# Altium schematic sheet Buttons.SchDoc
size Letter
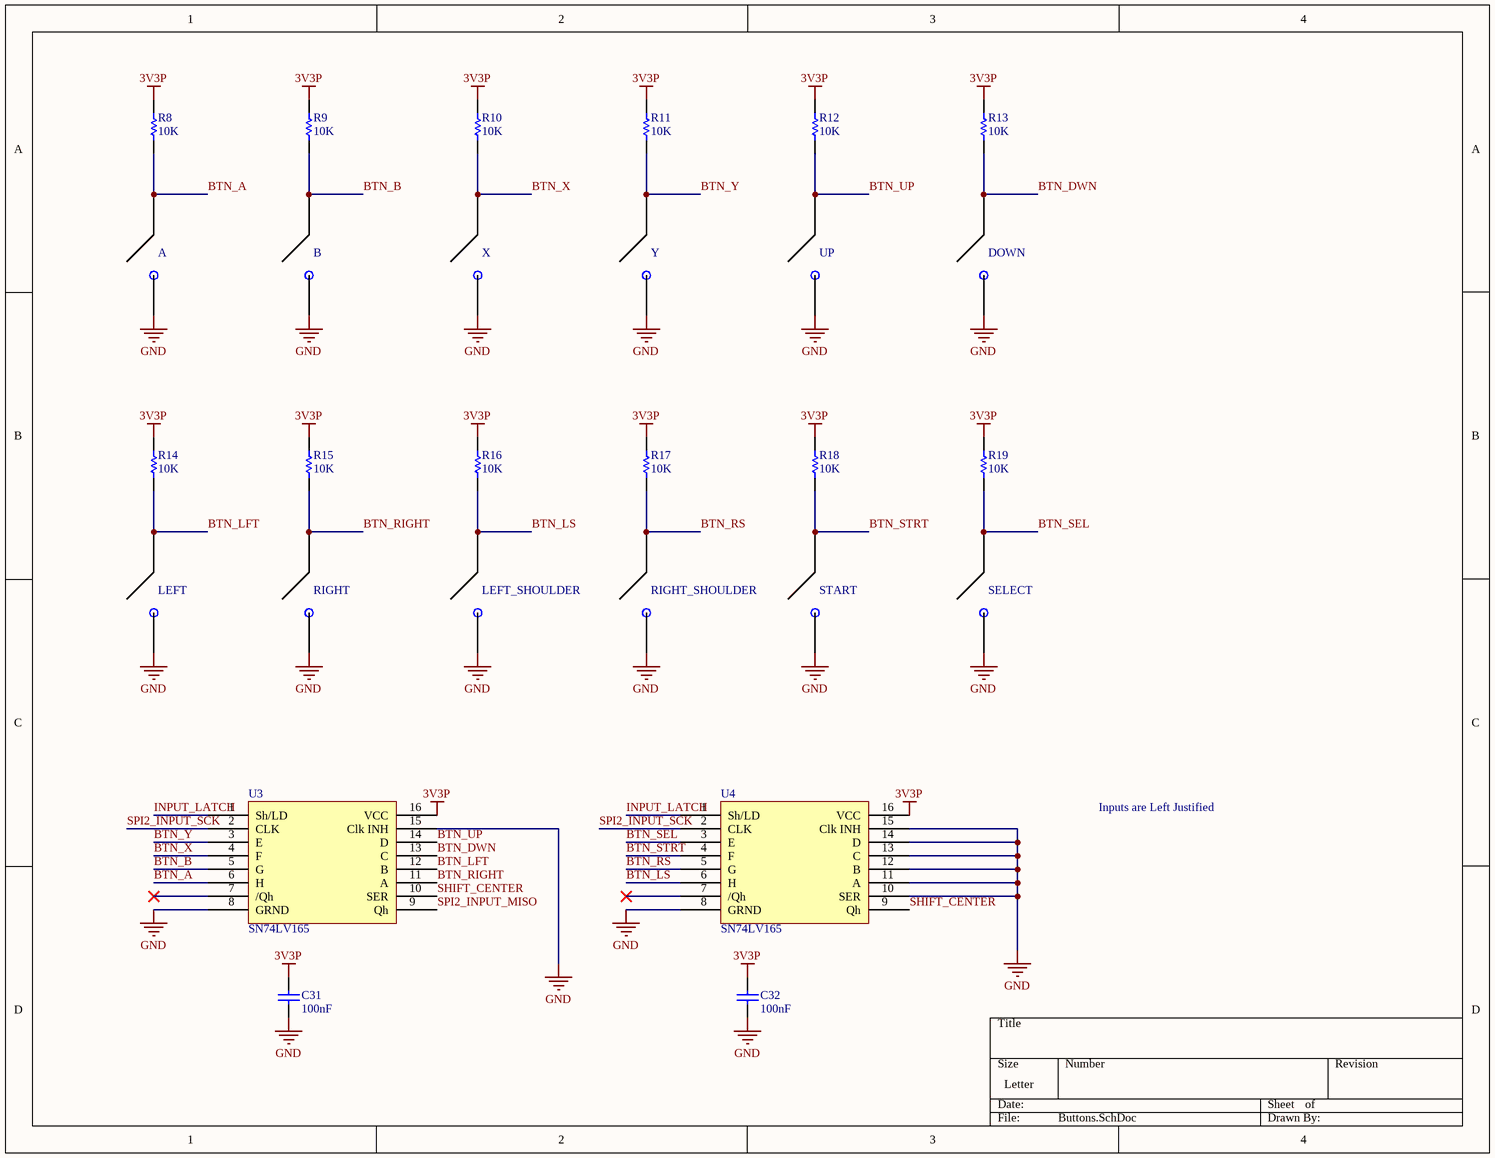
[diagram p0: Buttons.SchDoc]

## Parts
A  12mmBTN  [SMT12mmbutton]  (value not drawn)
B  12mmBTN  [SMT12mmbutton]  (value not drawn)
C31  100nF  [C0805]
C32  100nF  [C0805]
DOWN  12mmBTN  [SMT12mmbutton]  (value not drawn)
LEFT  12mmBTN  [SMT12mmbutton]  (value not drawn)
LEFT_SHOULDER  12mmBTN  [HDR1X2]  (value not drawn)
R8  10K  [6-0805_M]
R9  10K  [6-0805_M]
R10  10K  [6-0805_M]
R11  10K  [6-0805_M]
R12  10K  [6-0805_M]
R13  10K  [6-0805_M]
R14  10K  [6-0805_M]
R15  10K  [6-0805_M]
R16  10K  [6-0805_M]
R17  10K  [6-0805_M]
R18  10K  [6-0805_M]
R19  10K  [6-0805_M]
RIGHT  12mmBTN  [SMT12mmbutton]  (value not drawn)
RIGHT_SHOULDER  12mmBTN  [HDR1X2]  (value not drawn)
SELECT  12mmBTN  [SMT12mmbutton]  (value not drawn)
START  12mmBTN  [SMT12mmbutton]  (value not drawn)
U3  SN74LV165  [SOP16_Hand]
U4  SN74LV165  [SOP16_Hand]
UP  12mmBTN  [SMT12mmbutton]  (value not drawn)
X  12mmBTN  [SMT12mmbutton]  (value not drawn)
Y  12mmBTN  [SMT12mmbutton]  (value not drawn)

## Nets
3V3P: C31.2 C32.2 R8.1 R9.1 R10.1 R11.1 R12.1 R13.1 R14.1 R15.1 R16.1 R17.1 R18.1 R19.1 U3.16(VCC) U4.16(VCC)
GND: A.0 B.0 C31.1 C32.1 DOWN.0 LEFT.0 LEFT_SHOULDER.1 RIGHT.0 RIGHT_SHOULDER.1 SELECT.0 START.0 U3.8(GRND) U3.15(Clk_INH) U4.8(GRND) U4.10(SER) U4.11(A) U4.12(B) U4.13(C) U4.14(D) U4.15(Clk_INH) UP.0 X.0 Y.0
BTN_A: A.1 R8.2 U3.6(H)
BTN_B: B.1 R9.2 U3.5(G)
BTN_DWN: DOWN.1 R13.2 U3.13(C)
BTN_LFT: LEFT.1 R14.2 U3.12(B)
BTN_LS: LEFT_SHOULDER.2 R16.2 U4.6(H)
BTN_RIGHT: R15.2 RIGHT.1 U3.11(A)
BTN_RS: R17.2 RIGHT_SHOULDER.2 U4.5(G)
BTN_SEL: R19.2 SELECT.1 U4.3(E)
BTN_STRT: R18.2 START.1 U4.4(F)
BTN_UP: R12.2 U3.14(D) UP.1
BTN_X: R10.2 U3.4(F) X.1
BTN_Y: R11.2 U3.3(E) Y.1
INPUT_LATCH: U3.1(Sh/LD) U4.1(Sh/LD)
SHIFT_CENTER: U3.10(SER) U4.9(Qh)
SPI2_INPUT_MISO: U3.9(Qh)
SPI2_INPUT_SCK: U3.2(CLK) U4.2(CLK)

Not connected (* = marked no-connect by the designer): U3 7(/Qh)*; U4 7(/Qh)*

## Notes on the sheet
- Inputs are Left Justified

## Library data of the parts
C31 C32 = Cap: Capacitor; Published: 8-Jun-2000; LatestRevisionDate: 17-Jul-2002; LatestRevisionNote: Re-released for DXP Platform.; PackageReference: RAD-0.3; Publisher: Altium Limited; PackageDescription: Radial Cap, Thru-Hole; 2 Leads; 0.3 in Pin Spacing; Value: 100nF
R8-R19 = Res1: Resistor; Published: 8-Jun-2000; LatestRevisionDate: 17-Jul-2002; LatestRevisionNote: Re-released for DXP Platform.; PackageReference: AXIAL-0.3; Publisher: Altium Limited; PackageDescription: Axial Device, Thru-Hole; 2 Leads; 0.3 in Pin Spacing; Value: 10K